# Altium schematic sheet main.SchDoc: Lora Shield - Groundstation
size A4; Author: Gerald Ebmer; Address1: Gerald Ebmer; Address2: 1325683; Address3: Projekt LED Box; Address4: ACIN - TU WIEN; DocumentNumber: 1; Revision: 1.0
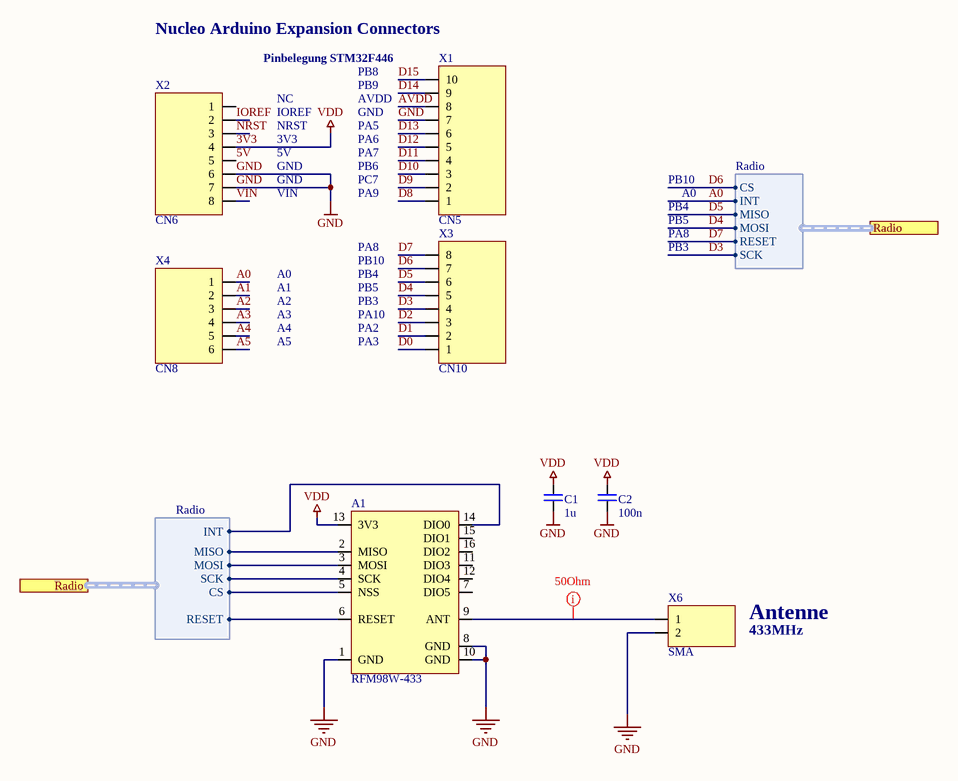
[diagram p0: main.SchDoc]

## Parts
A1  RFM98W-433  [RFM98W]
C1  1u  [0805]
C2  100n  [0805]
X1  CN5  [Header, 2.54mm pitch, 10pin]
X2  CN6  [Header, 2.54mm pitch, 8pin]
X3  CN10  [Header, 2.54mm pitch, 8pin]
X4  CN8  [Header, 2.54mm pitch, 6pin]
X6  SMA  [SMA]

## Ports
Radio (harness Radio)

## Harnesses
Radio: CS, INT, MISO, MOSI, RESET, SCK

## Nets
3V3: A1.13(3V3) C1.2 C2.2 X2.4  [also labelled VDD]
GND: A1.1(GND) A1.8(GND) A1.10(GND) C1.1 C2.1 X1.7 X2.6 X2.7 X6.2
5V: X2.5
A0: A1.14(DIO0) X4.1 ; port Radio.INT
A1: X4.2
A2: X4.3
A3: X4.4
A4: X4.5
A5: X4.6
AVDD: X1.8
D0: X3.1
D1: X3.2
D2: X3.3
D3: A1.4(SCK) X3.4 ; port Radio.SCK
D4: A1.3(MOSI) X3.5 ; port Radio.MOSI
D5: A1.2(MISO) X3.6 ; port Radio.MISO
D6: A1.5(NSS) X3.7 ; port Radio.CS
D7: A1.6(RESET) X3.8 ; port Radio.RESET
D8: X1.1
D9: X1.2
D10: X1.3
D11: X1.4
D12: X1.5
D13: X1.6
D14: X1.9
D15: X1.10
IOREF: X2.2
NRST: X2.3
VIN: X2.8
NetA1_9: A1.9(ANT) X6.1

Not connected (* = marked no-connect by the designer): A1 7(DIO5) 11(DIO3) 12(DIO4) 15(DIO1) 16(DIO2); X2 1

## Layout directives
net class Undefined: NetA1_9

## Notes on the sheet
- (near X1) Nucleo Arduino Expansion Connectors
- Pinbelegung STM32F446
- NC
- IOREF
- NRST
- PA5
- GND
- AVDD
- PB9
- PB8
- 3V3
- 5V
- VIN
- PA9
- PC7
- PB6
- PA7
- PA6
- PB10
- A0
- PA8
- PB3
- PB4
- PB5
- A1
- A2
- A3
- A4
- PA2
- PA10
- A5
- PA3
- 433MHz
- Antenne
- Title
- Size:
- Date:
- Number:
- Time:
- Revision:
- Sheet
- of
- File:

## Library data of the parts
A1 = RFM98W: LoRa Module / 433 MHz; Bestell-Nr.: RFM98W-433S2; Hersteller: HOPE MICROELECTRONICS; Lieferant: TME; Bauform: *; Bezeichnung: RFM98W-433S2; Preis: *
C1 = Kondensator: Bezeichnung: C0805C105K3RACTU; Hersteller: KEMET; Lieferant: Farnell; Bestell-Nr.: 1637035; Bauform: 0805
C2 = Kondensator: Bezeichnung: 08055C104KAT2A; Hersteller: AVX; Lieferant: RS Components; Bestell-Nr.: 464-6688; Bauform: 0805
X1 = Header 10pin: Bezeichnung: 5-826629-0; Bestell-Nr.: 3418388; Hersteller: AMP - TE CONNECTIVITY; Lieferant: Farnell; Preis: *; Bauform: *
X2 X3 = Header 8pin: Bezeichnung: *; Preis: *; Bestell-Nr.: *; Hersteller: *; Lieferant: *; Bauform: *
X4 = Header 6pin: Bezeichnung: *; Preis: *; Bestell-Nr.: *; Hersteller: *; Lieferant: *; Bauform: *
X6 = SMA: Hersteller: AMP - TE CONNECTIVITY; Lieferant: Farnell; Bezeichnung: 5-1814400-1; Bestell-Nr.: 1248989; Bauform: *; Preis: *